# Altium schematic sheet ed3.SchDoc
size 420 x 297 mm; SheetNumber: 1; SheetTotal: 1
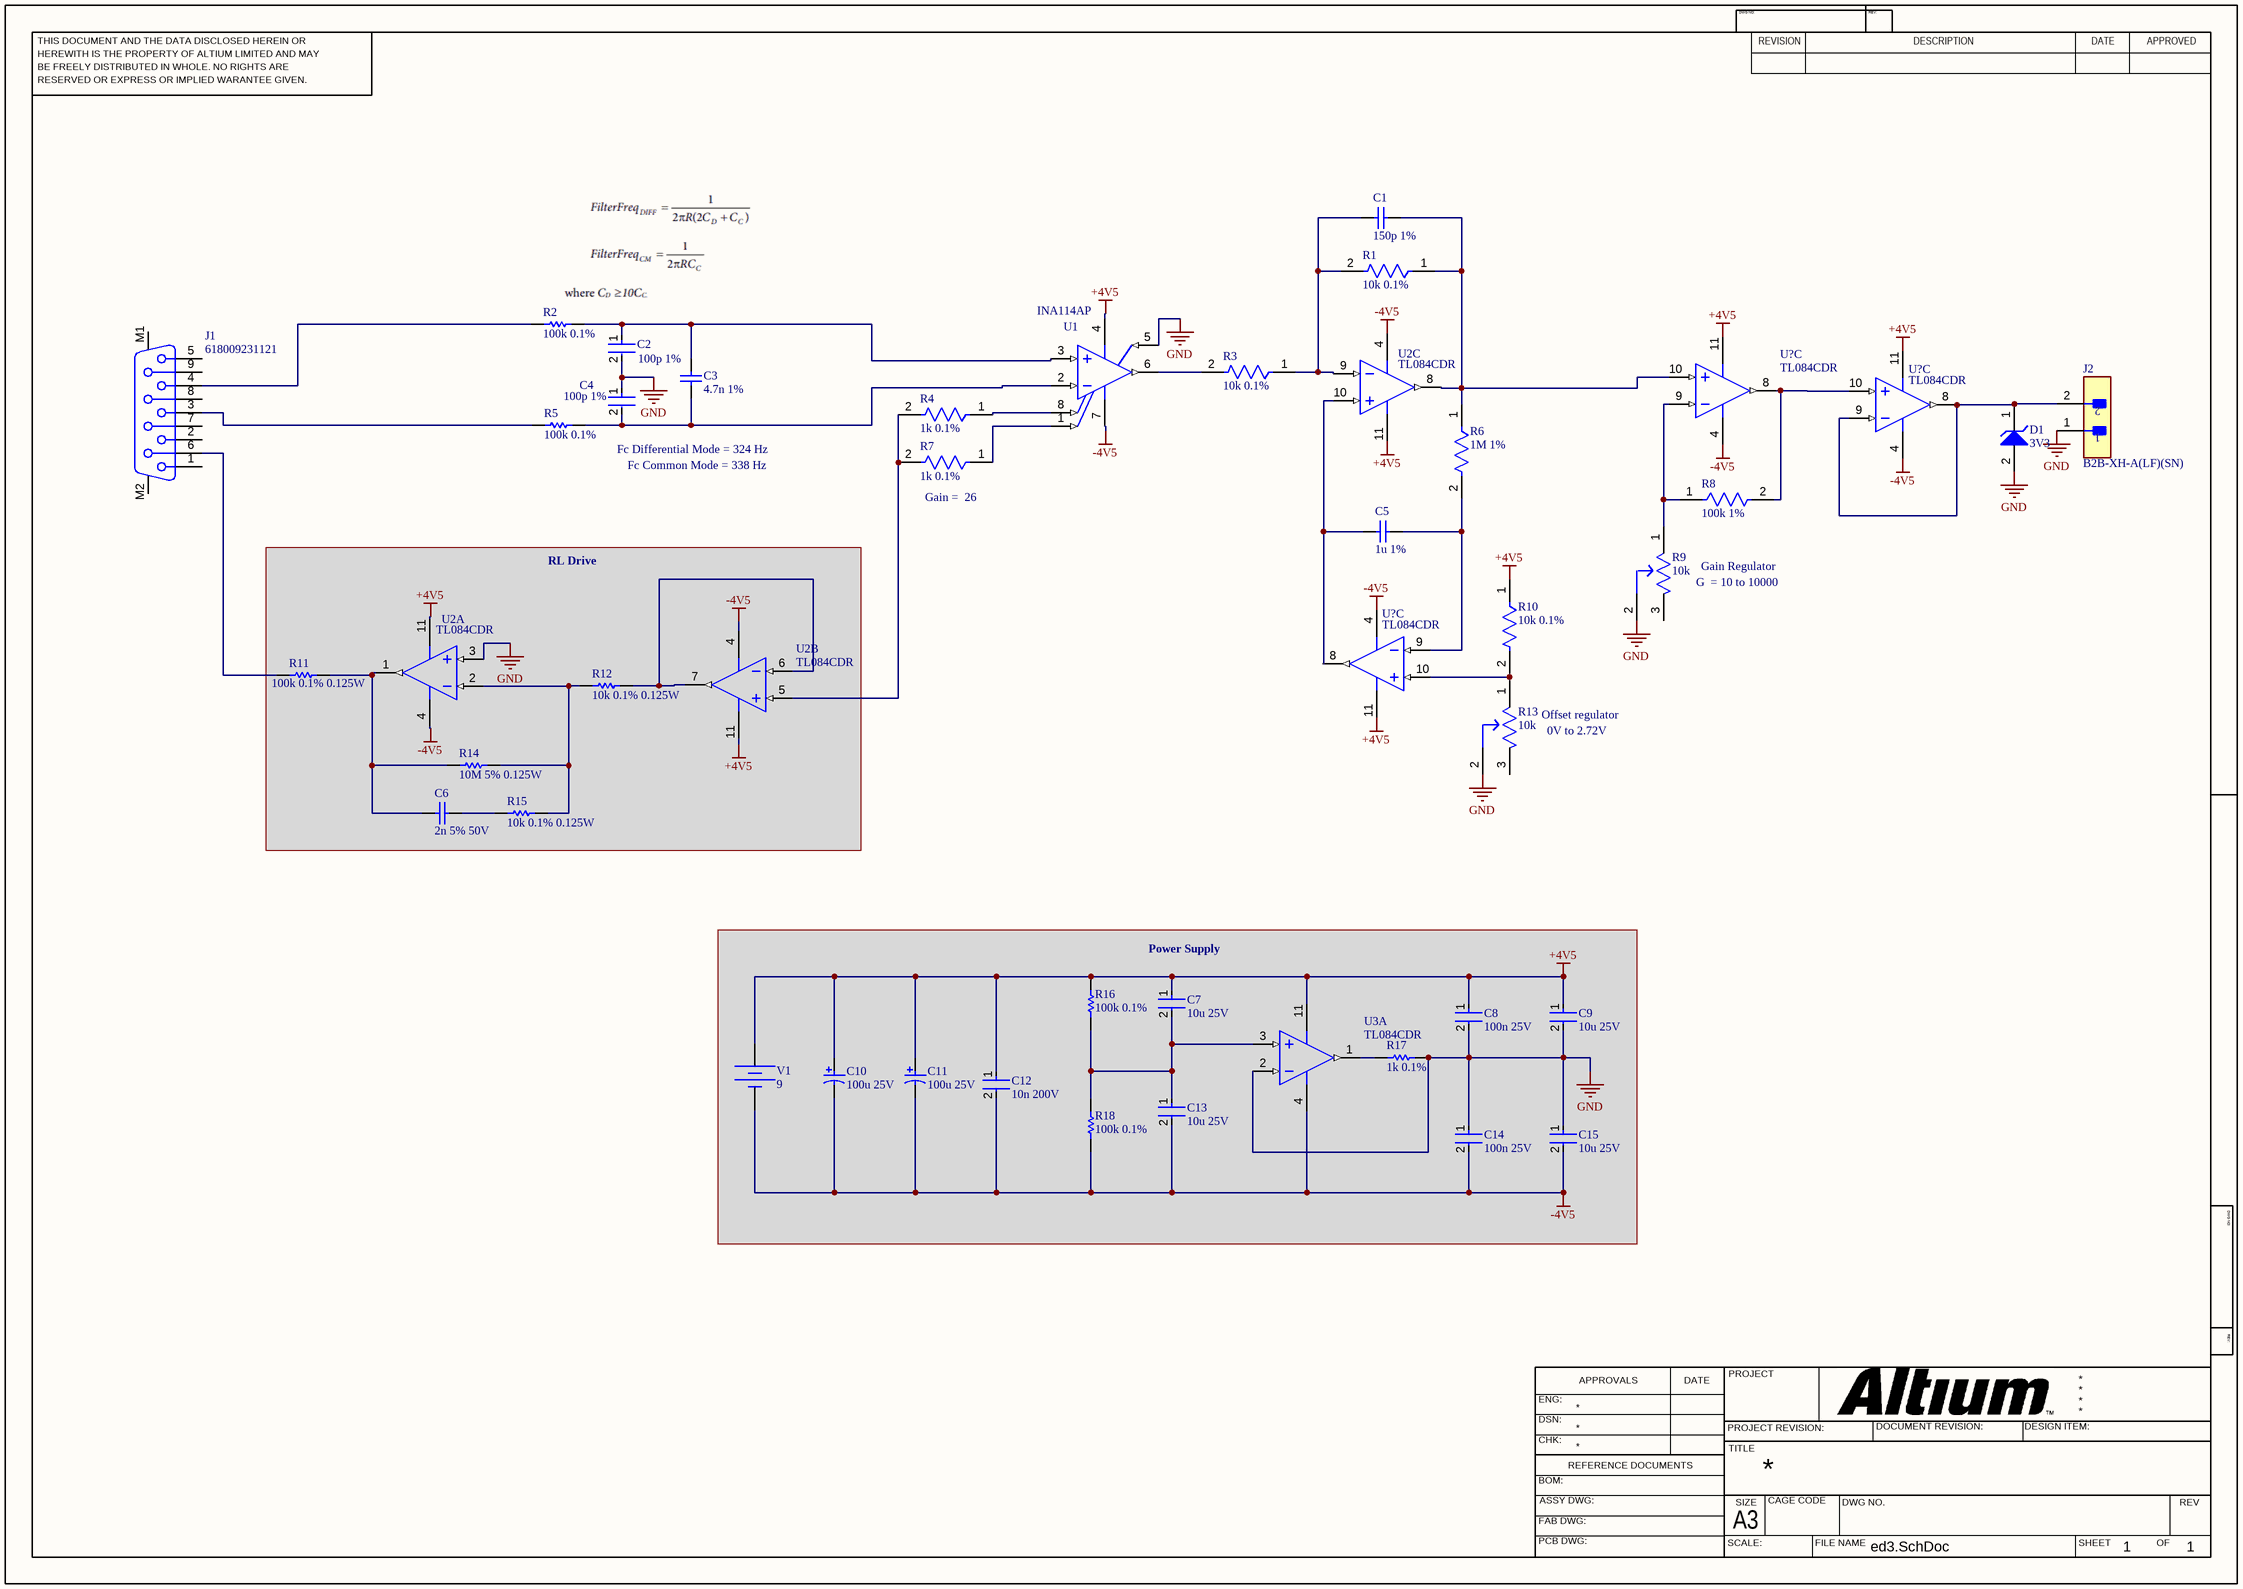
[diagram p0: ed3.SchDoc]

## Parts
(Parts that share a designator on the sheet are numbered #1, #2 ... from top to bottom, then left to right.)
C1  150p 1%  [CAPC2013X94X50ML20T25]
C2  100p 1%  [FP-0805-L_2_01_0_2-W_1_25-IPC_B]
C3  4.7n 1%  [CAPC2013X94X50ML20T25]
C4  100p 1%  [FP-0805-L_2_01_0_2-W_1_25-IPC_B]
C5  1u 1%  [CAPC2013X94X50ML20T25]
C6  2n 5% 50V  [CAPC2013X70X45NL10T25]
C7  10u 25V  [FP-GRM21B-0_15-IPC_C]
C8  100n 25V  [FP-C0805C-DN-MFG]
C9  10u 25V  [FP-GRM21B-0_15-IPC_C]
C10  100u 25V  [PNSC-FK-V-D8_V]
C11  100u 25V  [PNSC-FK-V-D8_V]
C12  10n 200V  [FP-0805-L_2_01_0_2-W_1_25-IPC_A]
C13  10u 25V  [FP-GRM21B-0_15-IPC_C]
C14  100n 25V  [FP-C0805C-DN-MFG]
C15  10u 25V  [FP-GRM21B-0_15-IPC_C]
D1  3V3  [ONSC-SOD-123-2-425-04_V]
J1  618009231121  [618009231121]
J2  B2B-XH-A(LF)(SN)  [FP-B2B-XH-A_LF_SN-MFG]
R1  10k 0.1%  [FP-ERA6A-IPC_C]
R2  100k 0.1%  [RESC2013X60X40LL20T25_A]
R3  10k 0.1%  [FP-ERA6A-IPC_C]
R4  1k 0.1%  [FP-ERA6A-IPC_C]
R5  100k 0.1%  [RESC2013X60X40LL20T25_A]
R6  1M 1%  [FP-ERA6A-IPC_C]
R7  1k 0.1%  [FP-ERA6A-IPC_C]
R8  100k 1%  [FP-ERA6A-IPC_C]
R9  10k  [FP-3266W-MFG]
R10  10k 0.1%  [FP-ERA6A-IPC_C]
R11  100k 0.1% 0.125W  [RESC2013X60X40LL20T25_A]
R12  10k 0.1% 0.125W  [RESC2013X60X40LL20T25_A]
R13  10k  [FP-3266W-MFG]
R14  10M 5% 0.125W  [RESC2013X50X30LL20T20]
R15  10k 0.1% 0.125W  [RESC2013X60X40LL20T25_A]
R16  100k 0.1%  [RESC2013X60X40LL20T25_A]
R17  1k 0.1%  [RESC2013X60X40LL20T25_A]
R18  100k 0.1%  [RESC2013X60X40LL20T25_A]
U1  INA114AP  [P0008A]
U2  TL084CDR  [D0014A_N]  (parts A,B,C of 4)
U3  TL084CDR  [D0014A_N]  (part A of 4)
U?#1  TL084CDR  [D0014A_N]  (part C of 4)
U?#2  TL084CDR  [D0014A_N]  (part C of 4)
U?#3  TL084CDR  [D0014A_N]  (part C of 4)
V1  DC Magnitude: 9  (hidden comment: Constant Voltage Source)

## Blocks framed on the sheet
RL Drive: C6 R11 R12 R14 R15 U2
Power Supply: C7-C15 R16-R18 U3 V1

## Nets
+4V5: C7.1 C8.1 C9.1 C10.1 C11.1 C12.1 R10.1 R16.2 U1.4(V-) U2.11(VCC-) U3.11(VCC-) U?#1.11(VCC-) U?#2.11(VCC-) U?#3.11(VCC-) V1.1
-4V5: C10.2 C11.2 C12.2 C13.2 C14.2 C15.2 R18.1 U1.7(V+) U2.4(VCC+) U3.4(VCC+) U?#1.4(VCC+) U?#2.4(VCC+) U?#3.4(VCC+) V1.2
GND: C2.2 C4.1 C8.2 C9.2 C14.1 C15.1 D1.2(A) J2.1 R9.2(WIPER) R13.2(WIPER) R17.1 U1.5(REF) U2.3(IN1+) U3.2(IN1-)
NetC1_1: C1.1 R1.1 R6.1 U2.8(OUT3) U?#1.10(IN3+)
NetC1_2: C1.2 R1.2 R3.1 U2.9(IN3-)
NetC2_1: C2.1 C3.2 R2.1 U1.3(VIN+)
NetC3_1: C3.1 C4.2 R5.1 U1.2(VIN-)
NetC5_1: C5.1 R6.2 U?#3.9(IN3-)
NetC5_2: C5.2 U2.10(IN3+)
NetC6_1: C6.1 R11.1 R14.1 U2.1(OUT1)
NetC6_2: C6.2 R15.2
NetC7_2: C7.2 C13.1 R16.1 R18.2 U3.3(IN1+)
NetD1_1: D1.1(K) J2.2 U?#2.8(OUT3) U?#2.9(IN3-)
NetJ1_3: J1.3 R5.2
NetJ1_4: J1.4 R2.2
NetJ1_6: J1.6 R11.2
NetR3_2: R3.2 U1.6(VO)
NetR4_1: R4.1 U1.8(RG)
NetR4_2: R4.2 R7.2 U2.5(IN2+)
NetR7_1: R7.1 U1.1(RG)
NetR8_1: R8.1 R9.1(CCW) U?#1.9(IN3-)
NetR8_2: R8.2 U?#1.8(OUT3) U?#2.10(IN3+)
NetR10_2: R10.2 R13.1(CCW) U?#3.10(IN3+)
NetR12_1: R12.1 U2.6(IN2-) U2.7(OUT2)
NetR12_2: R12.2 R14.2 R15.1 U2.2(IN1-)
NetR17_2: R17.2 U3.1(OUT1)

Not connected (* = marked no-connect by the designer): J1 1 2 5 7 8 9 M1 M2; R9 3(CW); R13 3(CW); U?#3 8(OUT3)

## Notes on the sheet
- Fc Differential Mode = 324 Hz
- Fc Common Mode = 338 Hz
- (near R7) Gain =  26
- (near R9) G  = 10 to 10000
- (near R9) Gain Regulator
- (near R13) Offset regulator
- (near R13) 0V to 2.72V
- THIS DOCUMENT AND THE DATA DISCLOSED HEREIN OR
- HEREWITH IS THE PROPERTY OF ALTIUM LIMITED AND MAY
- DWG NO:
- REVISION
- REV:
- DESCRIPTION
- DATE
- APPROVED
- BE FREELY DISTRIBUTED IN WHOLE. NO RIGHTS ARE
- RESERVED OR EXPRESS OR IMPLIED WARANTEE GIVEN.
- ENG:
- APPROVALS
- PROJECT
- DSN:
- CHK:
- REFERENCE DOCUMENTS
- PROJECT REVISION:
- TITLE
- DOCUMENT REVISION:
- DESIGN ITEM:
- BOM:
- FAB DWG:
- PCB DWG:
- ASSY DWG:
- SCALE:
- A3
- SIZE
- CAGE CODE
- FILE NAME
- DWG NO.
- SHEET
- OF
- REV

## Library data of the parts
C1 C3 C5 = CMP-1036-03569-3: Part Number: 08053A472FAT2A; Manufacturer: AVX Interconnect / Elco
C2 C4 = CMP-2007-04119-2: General Purpose Ceramic Capacitor, 0805, 100pF, 1%, C0G, 30ppm/°C, 100V; Max Operating Temperature: 125°C; Lead Free: Lead Free; Tolerance: 1%; Case Code (Imperial): 0805; Dielectric: C0G; RoHS Compliant: Yes; Termination: SMD/SMT; Packaging: Tape and Reel; Depth: 1.25mm; Dielectric Material: Ceramic; REACH SVHC: No SVHC; Thickness: 0.037inch; Case Code (Metric): 2012; Series: -; Mount: Surface Mount; Min Operating Temperature: -55°C; Voltage: 100V; Capacitance: 100pF; Length: 2.01mm; Number of Pins: 2; Radiation Hardening: No; Voltage Rating: 100V; Voltage Rating (DC): 100V; Height: 0.71mm; Width: 1.25mm; Case/Package: 0805; Construction: Flat; Package Quantity: 1
C6 = CMP-2007-00880-1: Part Number: GRM2165C1H202JA01D; Manufacturer: Murata
C7 C9 C13 C15 = CMP-2007-03541-2: Chip Multilayer Ceramic Capacitors for General Purpose, 0805, 10uF, X5R, 15%, 10%, 25V; Length: 2mm; Depth: 1.25mm; Termination: SMD/SMT; Voltage: 25V; Height: 1.25mm; Material: Ceramic; Thickness: 0.053inch; Radiation Hardening: No; Min Operating Temperature: -55°C; Width: 0.049inch; Package Quantity: 1; Mount: Surface Mount; Dielectric: X5R; Packaging: Tape and Reel; Capacitance: 10uF; Voltage Rating (DC): 25V; Lead Free: Lead Free; Max Operating Temperature: 85°C; Case Code (Imperial): 0805; Case/Package: 0805; Tolerance: 10%; Voltage Rating: 25V; Case Code (Metric): 2012
C8 C14 = CMP-2007-00282-2: CAP CER 0.1UF 25V 20% X7R 0805; Manufacturer: KEMET; Manufacturer Part Number: C0805C104M3RACTU; Temperature Coefficient: 30ppm/°C; Capacitance: 0.10 μF; Material: Ceramic; Tolerance: 0.2; Value: 0.10 μF; Digikey Description: CAP CER 0.1UF 25V 20% X7R 0805; Device Class L2: Capacitors; Temperature: -55°C to +125°C; Device Class L1: Passive Components; ComponentLink2Description: Datasheet; Mouser Description: Multilayer Ceramic Capacitors MLCC - SMD/SMT 25volts 0.1uF X7R 20%; Temperature Range High: +125°C; Device Class L3: Ceramic Capacitors; Package: C0805C-DN; Automotive: No; Temperature Range Low: -55°C; RoHS: TRUE; Category: Cap; Lead Free: Yes; Ipc Land Pattern Name: CAPC200125X78; Voltage Rating: 25 V; Height: 0.88mm; Temperature Characteristic: X7R; Octopart: https://octopart.com/c0805c104m3ractu-kemet-9138612; ComponentLink2URL: https://content.kemet.com/datasheets/KEM_C1003_C0G_SMD.pdf
C10 C11 = CMP-2000-06206-1: Aluminum Electrolytic Capacitor, 100 uF, +/- 20%, 25 V, 2-Pin SMD (Size Code D8), -55 to 105 degC, RoHS, Tape and Reel; Manufacturer: Panasonic; Type: Can; Lifetime@Temperature: 2000Hrs@105°C; Capacitance: 100µF; Ripple Current: 280mA; Impedance: 0.34O; Case Size/Dimension: Ø6.3x7.7mm; Operating Temp-Max: 105°C; Series: FK; Package URL: http://industrial.panasonic.com/cdbs/www-data/pdf/RDE0000/DME0000COL48.pdf; Mounting Technology: SurfaceMount; Package Description: 2-Pin Electrolytic Aluminum Capacitor, Body 6.6 x 6.6 mm; Datasheet Version: 03/2016; Datasheet URL: http://industrial.panasonic.com/cdbs/www-data/pdf/RDE0000/ABA0000C1181.pdf; Manufacturer URL: http://www.panasonic.com/; Package Reference: FK-V-D8; Rated Voltage: 25V; Operating Temp Range: -55to+105°C
C12 = CMP-2007-04596-2: General Purpose Ceramic Capacitor, 0805, 10nF, 10%, X7R, 0.15, 200V; Dissipation Factor: 2.5%; Package Quantity: 1; Case/Package: 0805; Case Code (Metric): 2012; Voltage Rating: 200V; Voltage: 200V; Number of Pins: 2; Depth: 1.25mm; Length: 2.01mm; Dielectric: X7R; Lead Free: Lead Free; Mount: Surface Mount; REACH SVHC: No SVHC; Packaging: Tape and Reel; Termination: SMD/SMT; Radiation Hardening: No; Thickness: 0.037inch; Tolerance: 10%; Min Operating Temperature: -55°C; RoHS Compliant: Yes; Dielectric Material: Ceramic; Voltage Rating (DC): 200V; Contact Plating: Tin; Height: 0.94mm; Width: 0.049inch; Lead Pitch: 5.08mm; Case Code (Imperial): 0805; Capacitance: 10nF; Max Operating Temperature: 125°C
D1 = CMP-1060-00363-1: Zener Voltage Regulator, 500 mW, 2-Pin SOD-123, Pb-Free, Tape and Reel; PartNumber: MMSZ5226BT1G; Manufacturer: On Semiconductor; P Max (W): 0.5; VZ Typ (V): 3.3; ComponentLink1Description: Manufacturer URL; ComponentLink3URL: http://www.onsemi.com/pub_link/Collateral/425-04.PDF; ComponentLink3Description: Package Specification; ComponentLink2Description: Datasheet; ComponentLink1URL: http://www.onsemi.com/; Mounting Technology: Surface Mount; Packing: Tape and Reel; PackageDescription: 2-Pin SOD, Body 1.6 x 2.69 mm; ComponentLink2URL: http://www.onsemi.com/pub_link/Collateral/MMSZ5221BT1-D.PDF; RoHS: Pb-Free; PackageVersion: Rev. G, 10/2009; PackageReference: SOD-123-2-425-04; DatasheetVersion: Rev. 12
J1 = CMP-1502-00200-2: NexarPartId: 18818187; Insulation Resistance: 5GΩ; Current Rating: 3A; Number of Contacts: 9; Contact Resistance: 30mΩ; Operating Supply Voltage: 125V; Gender: Female; Pitch: 2.77mm; Length: 30.8mm; Contact Material: Gold, Nickel; Insulation Material: PBT; RoHS: Compliant; Width: 12.5mm; Termination: SMD/SMT; Height: 12.7mm; Housing Material: Steel; Number of Pins: 9; Max Operating Temperature: 105°C; Mount: Through Hole; Contact Plating: Gold; Depth: 18.5mm; Min Operating Temperature: -55°C; REACH SVHC: Unknown; Number of Rows: 2; Orientation: Right Angle; Voltage Rating: 125V
J2 = CMP-2000-05888-3: CONN HEADER VERT 2POS 2.5MM; Current Rating: 3A; Voltage Rating: 250V; Number of Contacts: 2; Contact Resistance: 20mR; Wire/Cable Gauge: 22AWG; Insulation Resistance: 1GR; Connector Type: Male Pin; Packaging: Bulk; Contact Material: Brass; Lead Free: Lead Free; Orientation: Straight; Contact Plating: Tin; Max Current Rating: 3A; Termination: Solder; Fastening Type: Detent; Depth: 5.75mm; Housing Material: Polyamide; REACH SVHC: No SVHC; Series: XH; Voltage Rating (AC): 250V; Number of Positions: 2; Color: Natural; Contact Type: Male Pin; Max Voltage Rating (DC): 250V; Pitch: 2.5mm; Lead Pitch: 2.5mm; Mount: Through Hole; Max Operating Temperature: 85°C; Length: 7.4mm; Max Voltage Rating (AC): 250V; Min Operating Temperature: -25°C; Number of Rows: 1; Housing Color: White
R1 R3 R4 R6-R8 R10 = CMP-2001-00581-2: RES 1K OHM 0.1% 1/8W 0805; Temperature Coefficient: 25ppm/°C; Resistance: 1kR; Working Voltage: 100V; Max Power Dissipation: 125mW; Height: 0.5mm; Technology: THIN FILM; REACH SVHC: No SVHC; Packaging: Tape and Reel; Length: 2mm; Width: 1.25mm; Resistance Tolerance: 0.1%; Series: ERA-6A; Resistor Type: Thin Film; Number of Pins: 2; Case Code (Metric): 2012; Voltage Rating: 100V; Radiation Hardening: No; Construction: Rectangular; Mount: Surface Mount; Number of Terminations: 2; Case/Package: 0805; Min Operating Temperature: -55°C; Military Standard: Not; RoHS Compliant: Yes; Termination: SMD/SMT; Case Code (Imperial): 0805; Depth: 1.25mm; Power Rating: 125mW; Max Operating Temperature: 155°C; Contact Plating: Tin; Package Quantity: 5000; Tolerance: 0.1%
R2 R5 R11 R12 R15-R18 = CMP-2001-00582-2: Metal Film Chip Resistor, High Reliability Type, 0.125 W, +/- 0.1%, -55 to 155 degC, 0805 (2012 Metric), RoHS, Tape and Reel; Voltage Rating: 100V; Power Rating: 125mW(1/8W); Brand: Panasonic; Temperature Coefficient: 25PPM/C; Resistance: 10kOhms; Product Category: ThinFilmResistors-SMD; Datasheet Version: 02/2016; Operating Temperature Range: -55Cto+155C; Length: 2mm; Mounting Technology: SurfaceMount; Manufacturer URL: http://www.panasonic.com/; Width: 1.25mm; Packaging: Reel; Product: ThinFilmResistorsSMD; Package / Case: 0805(2012metric); Termination Style: SMD/SMT; Tolerance: 0.1%; Datasheet URL: https://industrial.panasonic.com/cdbs/www-data/pdf/RDM0000/AOA0000C307.pdf; Package Description: 2-Pin Surface Mount Device, Body 2 x 1.25 mm; Factory Pack Quantity: 5000; Series: ERA-6A; Case Code - mm: 2012; RoHS: Details; Package Reference: 0805; Height: 0.5mm; Manufacturer: Panasonic; Case Code - in: 0805; Type: MetalFilmChipResistors
R9 R13 = CMP-07234-000016-1: TRIMMER 10K OHM 0.25W PC PIN TOP; Manufacturer: Bourns; Manufacturer Part Number: 3266W-1-103LF; Temperature Coefficient: 100ppm/°C; Tolerance: 10%; Value: 10kΩ; Standoff Height: 0.43mm; Device Class L3: Variable Resistors and Potentiometers; ComponentLink2URL: https://www.bourns.com/docs/Product-Datasheets/3266.pdf; ComponentLink2Description: Datasheet; Device Class L2: Resistors; Power Rating: 0.25W; Mouser Description: Trimmer Resistors - Through Hole 1/4 10Kohms 10% SQ W/Standoff Sealed; Category: Res; Digikey Description: TRIMMER 10K OHM 0.25W PC PIN TOP; Device Class L1: Passive Components; Octopart: https://octopart.com/3266w-1-103lf-bourns-81445; Height: 9.02mm; Temperature Range High: +125°C; Series: 3266; Temperature Range Low: -55°C; Composition: Cermet; Resistance: 10kΩ; Lead Free: Yes; RoHS: TRUE; Automotive: No; Package: 3266W; Temperature: -55°C to +125°C
R14 = CMP-2001-04285-1: Part Number: CRCW080510M0JNEA; Manufacturer: Vishay Dale
U1 = CMP-0992-00143-2: Precision Instrumentation Amplifier, -40 to 85 degC, 8-pin DIP (P8), Green (RoHS & no Sb/Br); Manufacturer: Texas Instruments; Vs(Max)(V): 36; Input Bias Current (+/-)(Max)(nA): 5; Output Offset Drift (+/-)(Max)(uV/Degrees Celsius): 10/G; Non-Linearity (+/-)(Max)(%): 0.004; CMRR(Min)(dB): 106; Output Offset (+/-)(Max)(uV): 500/G; Quiescent Current (+/-)(Typ)(mA): 2.2; Vs(Min)(V): 4.5; Input Offset Drift (+/-)(Max)(uV/Degrees Celsius): 1; Gain(V/V): 1 to 10000; SubFamily: Dual Supply; Input Offset (+/-)(Max)(uV): 125; Noise at 1kHz(Typ)(nV/rt(Hz)): 11; PackageDescription: 8-Pin Plastic In-Line, Body 9.59 x 6.35 mm, Pitch 2.54 mm; Eco-Plan: Green (RoHS & no Sb/Br); ComponentLink3Description: Package Specification; ComponentLink3URL: http://www.ti.com/litv/pdf/mpdi001b; ComponentLink1URL: http://www.ti.com/; PackageReference: P0008A; DatasheetVersion: SBOS014; PackageVersion: 4040082/E, 04/2010; PartNumber: INA114AP; Mounting Technology: Through Hole; ComponentLink2URL: http://www.ti.com/general/docs/lit/getliterature.tsp?genericPartNumber=INA114&fileType=pdf; ComponentLink1Description: Manufacturer URL; Number of Channels: 1; ComponentLink2Description: Datasheet; Code_JEDEC: MS-001
U2 U3 U?#1-U?#3 = CMP-0017-00129-2: JFET-Input Operational Amplifier, 7 to 36 V, 0 to 70 degC, 14-pin SOIC (D14), Green (RoHS & no Sb/Br); Manufacturer: Texas Instruments; Sub Family: General Purpose Amplifier, High Supply Voltage Amplifier (>=30V); CMRR(Min)(dB): 70; Vio (25C)(Max)(mV): 15; Number of Channels: 4; Slew Rate(Typ)(V/us): 13; Iq per channel(Max)(mA): 2.8; Rating: Catalog; IIB(Max)(pA): 400; Total Supply Voltage(Min)(+5V is 5, +/-5V is 10): 7; Vn at 1kHz(Typ)(nV/rtHz): 18; Total Supply Voltage(Max)(+5V is 5, +/-5V is 10): 36; GBW(Typ)(MHz): 3; PartNumber: TL084CDR; ComponentLink2Description: Datasheet; Eco-Plan: Green (RoHS & no Sb/Br); ComponentLink1Description: Manufacturer URL; PackageVersion: 4040047-5/M, 06/2011; ComponentLink2URL: http://www.ti.com/lit/ds/symlink/tl084.pdf; Mounting Technology: Surface Mount; ComponentLink3Description: Package Specification; ComponentLink3URL: http://www.ti.com/lit/ml/mpds177g/mpds177g.pdf; DatasheetVersion: SLOS081G; PackageDescription: 14-Pin Plastic Small Outline, Body 8.65 x 3.90 mm, Pitch 1.27 mm; PackageReference: D0014A; Offset Drift(Typ)(uV/C): 18; Code_JEDEC: MS-012; ComponentLink1URL: http://www.ti.com/
V1 = Battery: SimulationGenericComponent: True